# EAGLE schematic Expansion_board (EAGLE 9.2.0)
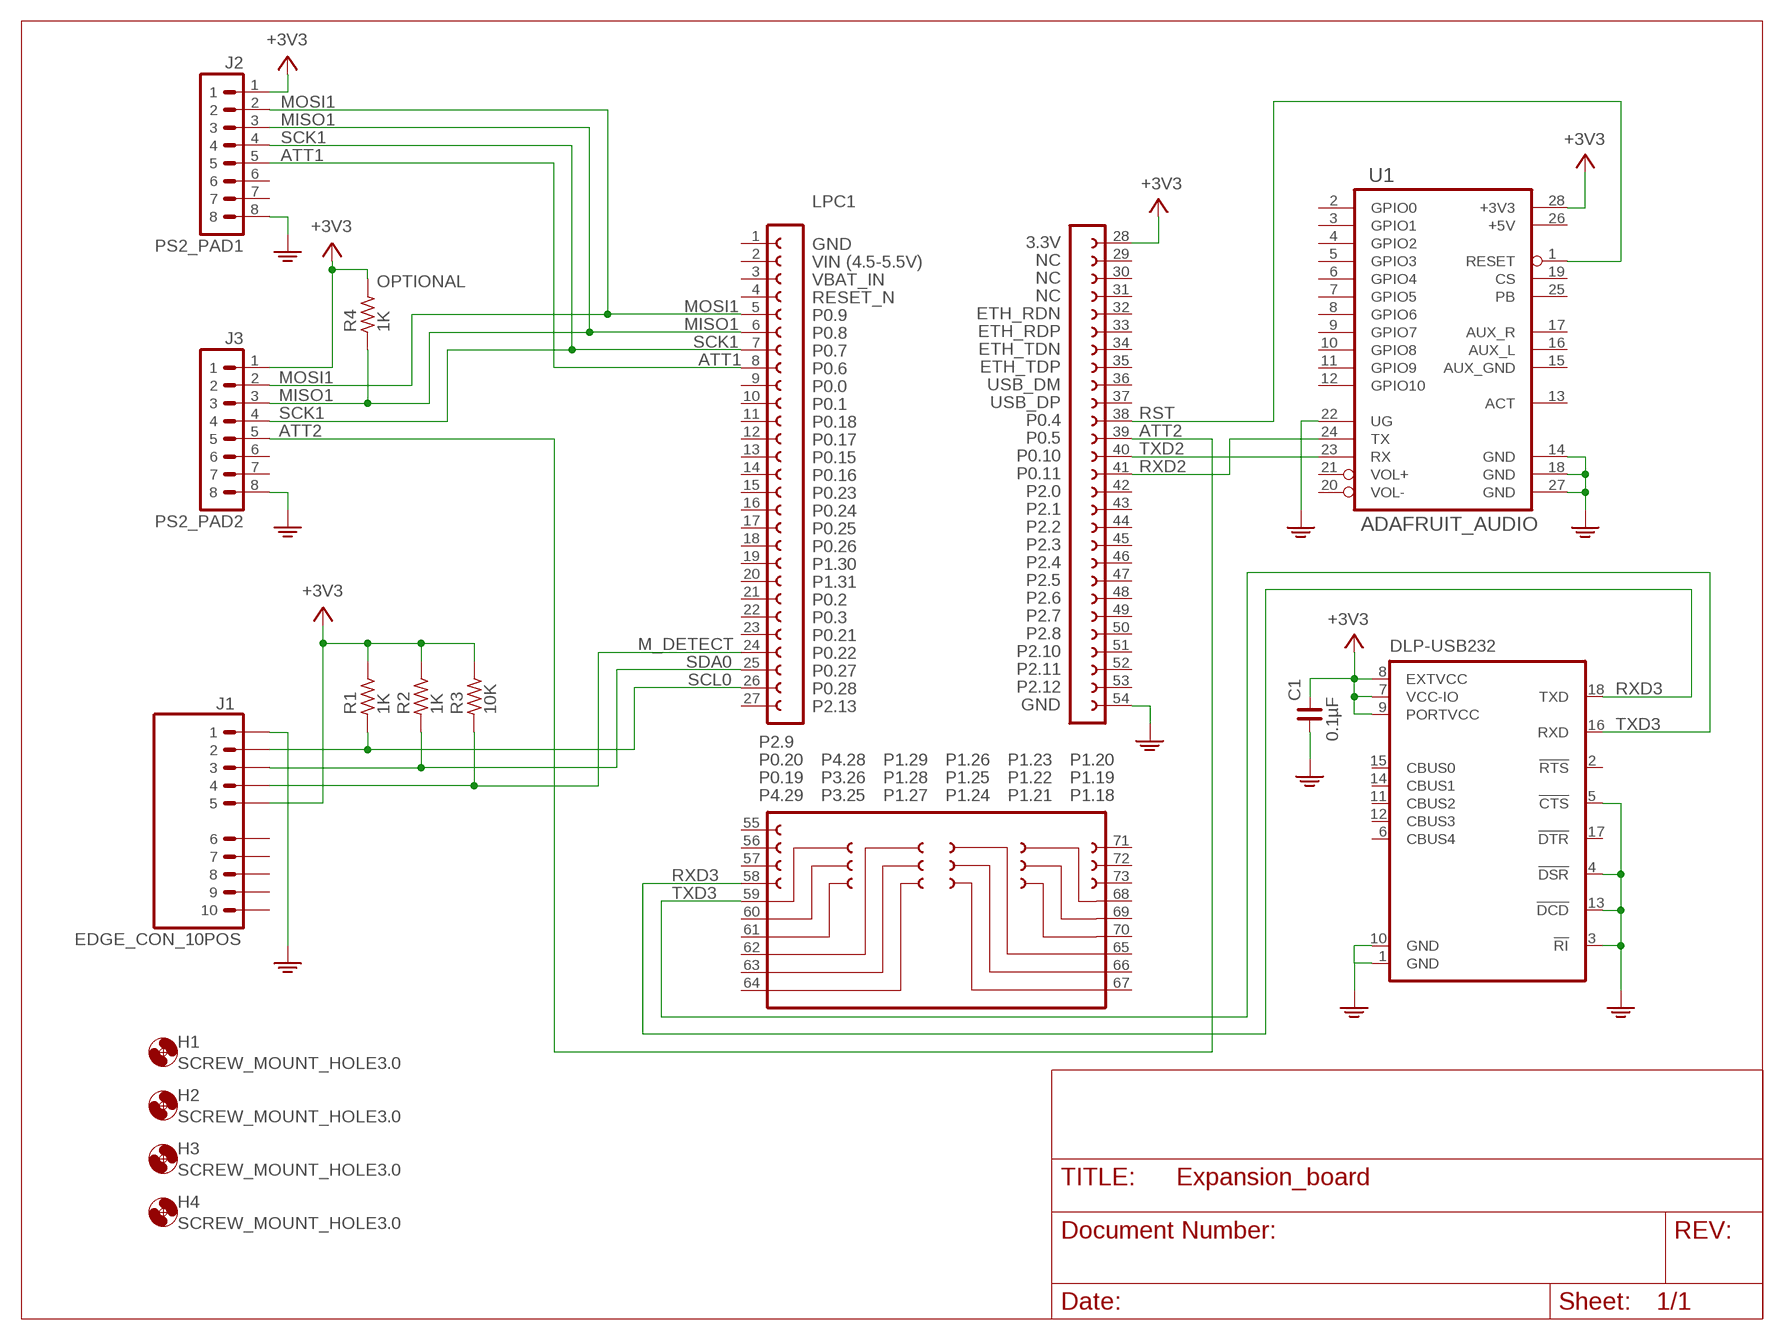
[diagram p0: schematic, sheet 1]

## Parts
C1  0.1µF  C_1206  [C1206]
H1  SCREW_MOUNT_HOLE3.0  [3MM_HOLE]
H2  SCREW_MOUNT_HOLE3.0  [3MM_HOLE]
H3  SCREW_MOUNT_HOLE3.0  [3MM_HOLE]
H4  SCREW_MOUNT_HOLE3.0  [3MM_HOLE]
J1  EDGE_CON_10POS  [EDGE_CON_10POS]
J2  PS2_PAD1  MOLEX_CON_8POSSMD_43045_0807  [MOLEX43045_0806]
J3  PS2_PAD2  MOLEX_CON_8POSSMD_43045_0807  [MOLEX43045_0806]
LPC1  LPCXPRESSO_LPC1769  [LPCXPRESSO_LPC1769]
R1  1K  R_1206  [R1206]
R2  1K  R_1206  [R1206]
R3  10K  R_1206  [R1206]
R4  1K  R_1206  [R1206]
U1  ADAFRUIT_AUDIO  ADAFRUIT_AUDIO_FX_SOUND_BOARD  [AUDIO_FX_SOUND_BOARD]
U$1  DLP-USB232  [DLP-USB232]

## Nets
+3V3: C1.2 J1.5 J2.1 J3.1 LPC1.28 R1.2 R2.2 R3.2 R4.2 U1.28(+3V3) U$1.7(VCC-IO) U$1.8(EXTVCC) U$1.9(PORTVCC)
ATT1: J2.5 LPC1.8
ATT2: J3.5 LPC1.39
GND: C1.1 J1.1 J2.8 J3.8 LPC1.54 U1.14(GND) U1.18(GND) U1.22(UG) U1.27(GND) U$1.1(GND) U$1.3(!RI) U$1.4(!DSR) U$1.5(!CTS) U$1.10(GND) U$1.13(!DCD)
M_DETECT: J1.4 LPC1.24 R3.1
MISO1: J2.3 J3.3 LPC1.6 R4.1
MOSI1: J2.2 J3.2 LPC1.5
RST: LPC1.38 U1.1(RESET)
RXD2: LPC1.41 U1.24(TX)
RXD3: LPC1.58 U$1.18(TXD)
SCK1: J2.4 J3.4 LPC1.7
SCL0: J1.2 LPC1.26 R1.1
SDA0: J1.3 LPC1.25 R2.1
TXD2: LPC1.40 U1.23(RX)
TXD3: LPC1.59 U$1.16(RXD)
Unconnected: J1.6 J1.7 J1.8 J1.9 J1.10 J2.6 J2.7 J3.6 J3.7 LPC1.1 LPC1.2 LPC1.3 LPC1.4 LPC1.9 LPC1.10 LPC1.11 LPC1.12 LPC1.13 LPC1.14 LPC1.15 LPC1.16 LPC1.17 LPC1.18 LPC1.19 LPC1.20 LPC1.21 LPC1.22 LPC1.23 LPC1.27 LPC1.29 LPC1.30 LPC1.31 LPC1.32 LPC1.33 LPC1.34 LPC1.35 LPC1.36 LPC1.37 LPC1.42 LPC1.43 LPC1.44 LPC1.45 LPC1.46 LPC1.47 LPC1.48 LPC1.49 LPC1.50 LPC1.51 LPC1.52 LPC1.53 LPC1.55 LPC1.56 LPC1.57 LPC1.60 LPC1.61 LPC1.62 LPC1.63 LPC1.64 LPC1.65 LPC1.66 LPC1.67 LPC1.68 LPC1.69 LPC1.70 LPC1.71 LPC1.72 LPC1.73 U1.2(GPIO0) U1.3(GPIO1) U1.4(GPIO2) U1.5(GPIO3) U1.6(GPIO4) U1.7(GPIO5) U1.8(GPIO6) U1.9(GPIO7) U1.10(GPIO8) U1.11(GPIO9) U1.12(GPIO10) U1.13(ACT) U1.15(AUX_GND) U1.16(AUX_L) U1.17(AUX_R) U1.19(CS) U1.20(VOL-) U1.21(VOL+) U1.25(PB) U1.26(+5V) U$1.2(!RTS) U$1.6(CBUS4) U$1.11(CBUS2) U$1.12(CBUS3) U$1.14(CBUS1) U$1.15(CBUS0) U$1.17(!DTR)

## Notes on the sheet
- OPTIONAL

## Library data of the parts
C1 = xavier:C_: NON-POLARIZED CAP
H1-H4 = xavier:SCREW_MOUNT_HOLE: MOUNTING HOLE with drill center marker
J1 = xavier:EDGE_CON_10POS
J2 J3 = xavier:MOLEX_CON_8POS
LPC1 = xavier:LPCXPRESSO_LPC1769
R1-R4 = xavier:R_: RESISTOR
U1 = xavier:ADAFRUIT_AUDIO_FX_SOUND_BOARD
U$1 = DLP-USB232:DLP-USB232